# Altium project HQ_RPI_T113_V04_162.PrjPcb (part 1 of 2)
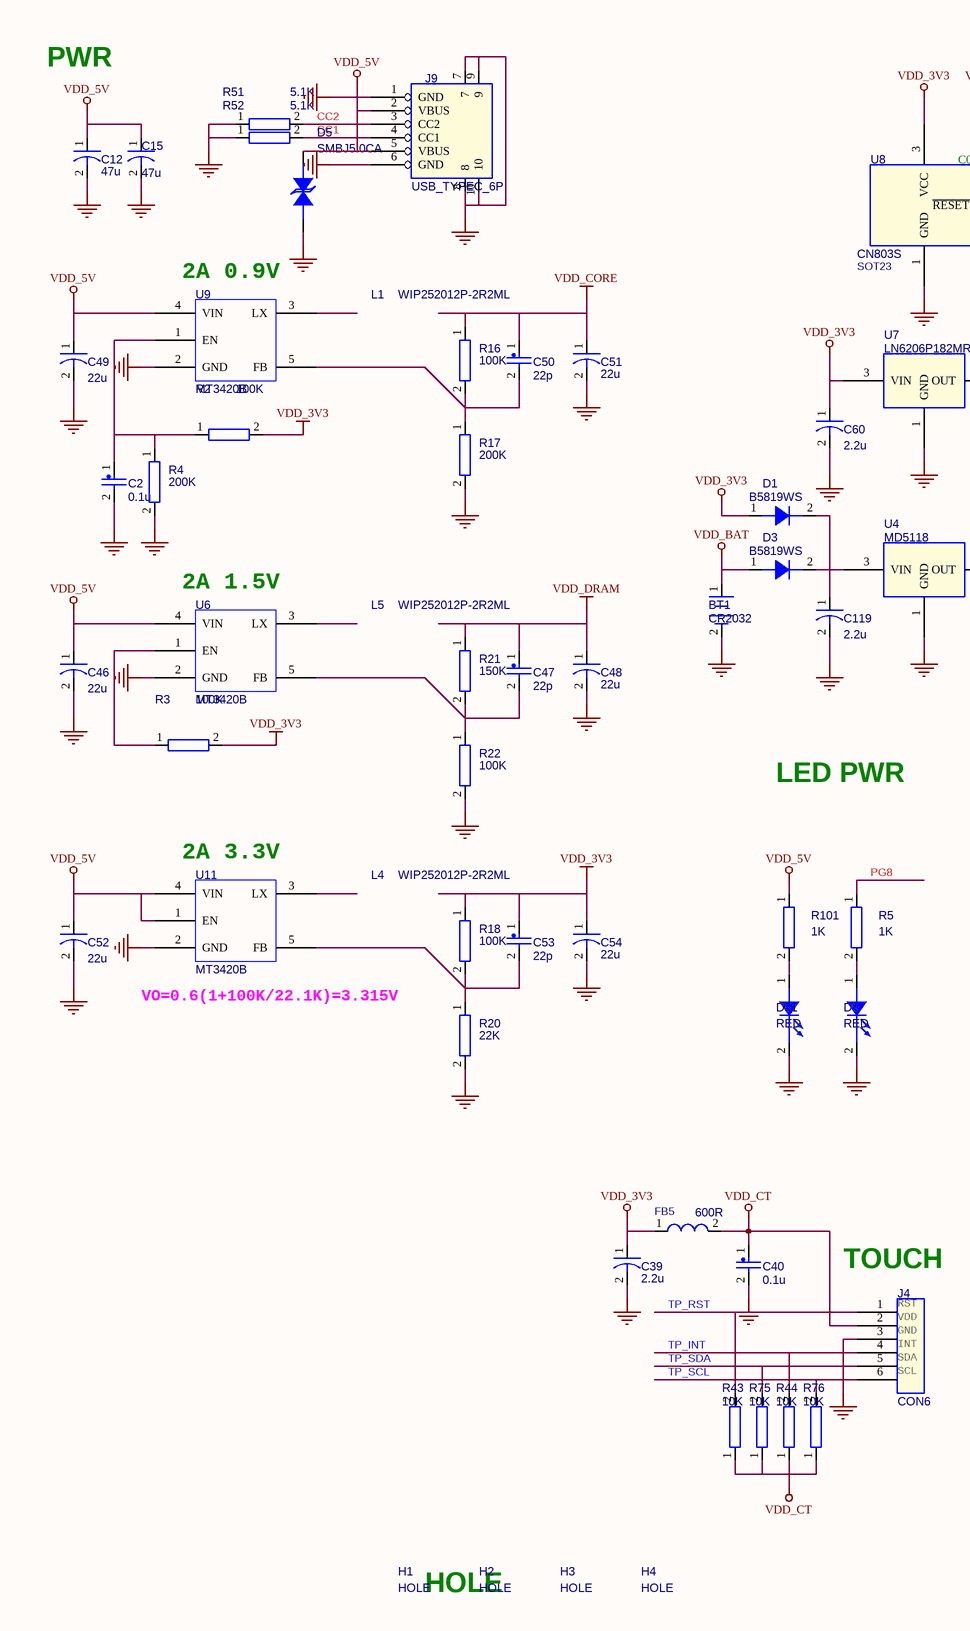
[diagram p0: MAIN.SchDoc, top left]
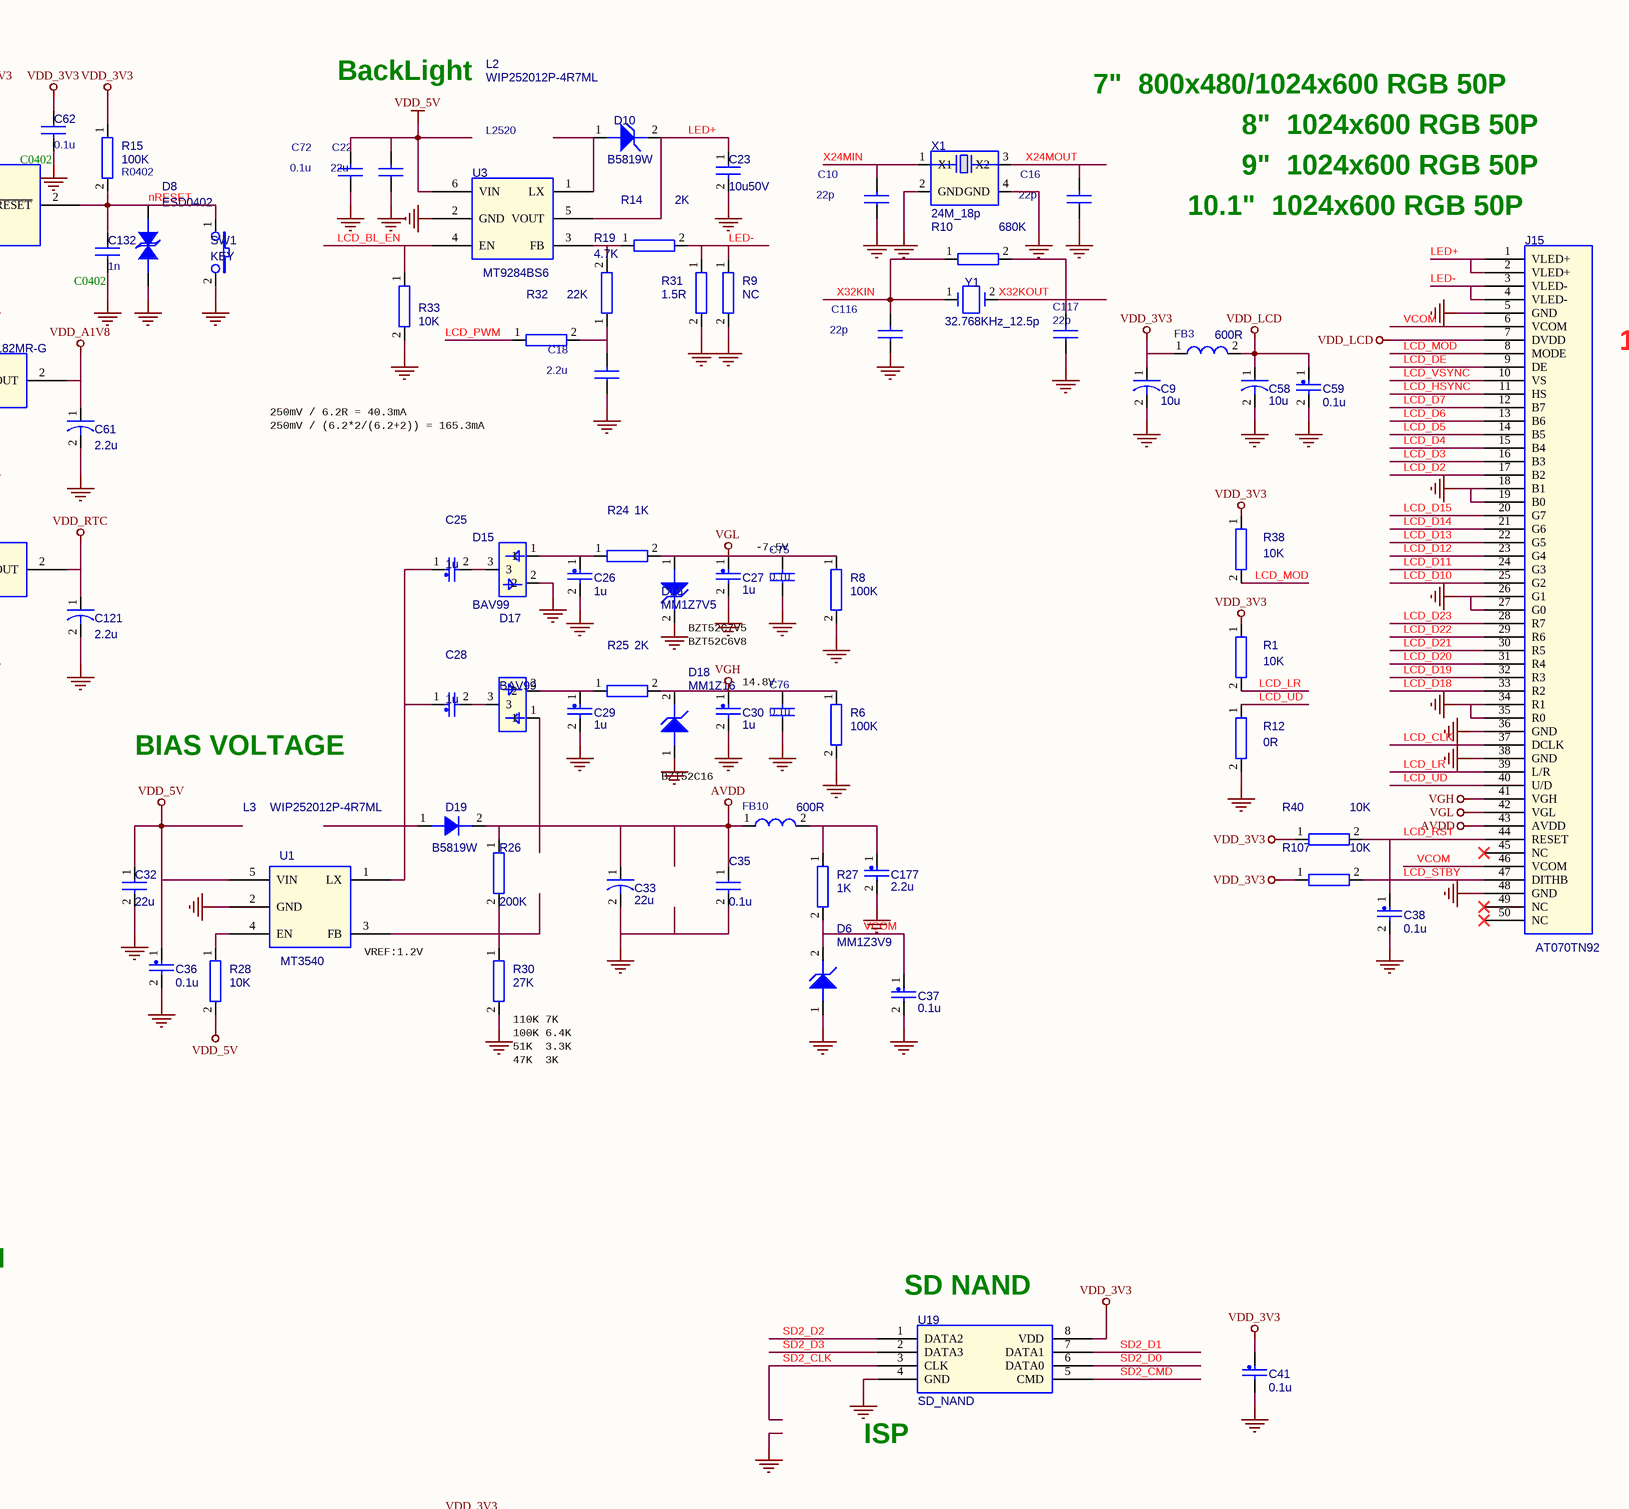
[diagram p1: MAIN.SchDoc, top middle]
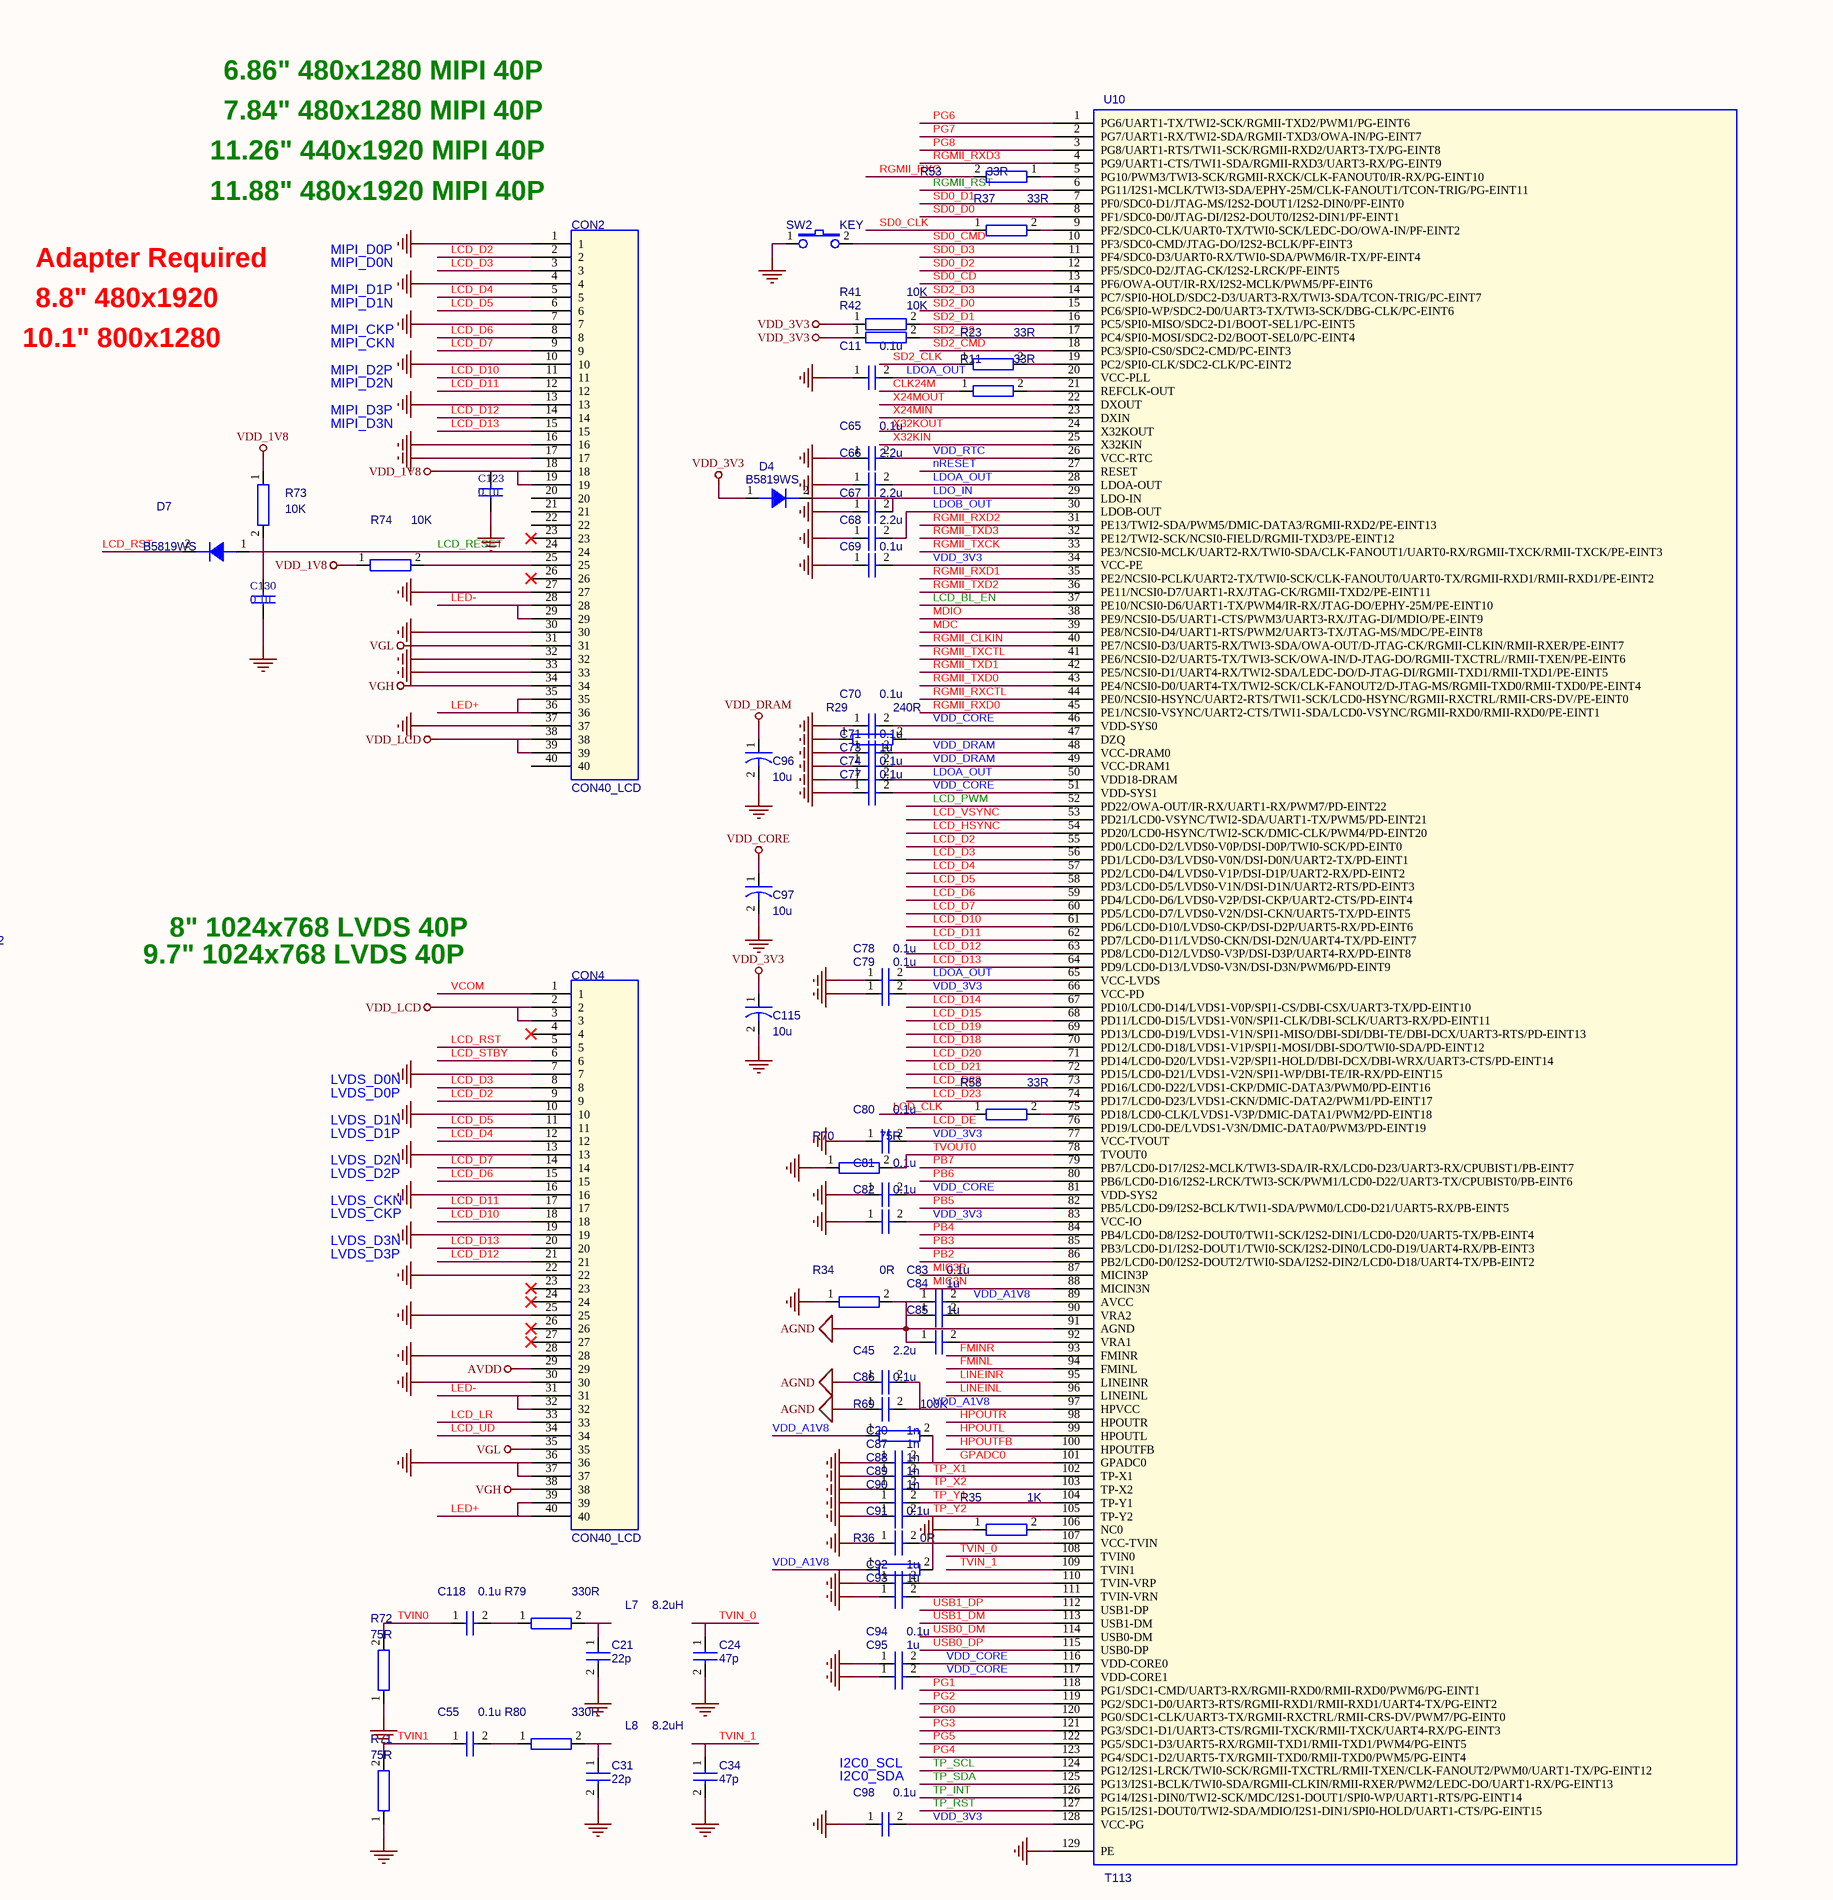
[diagram p2: MAIN.SchDoc, top right]
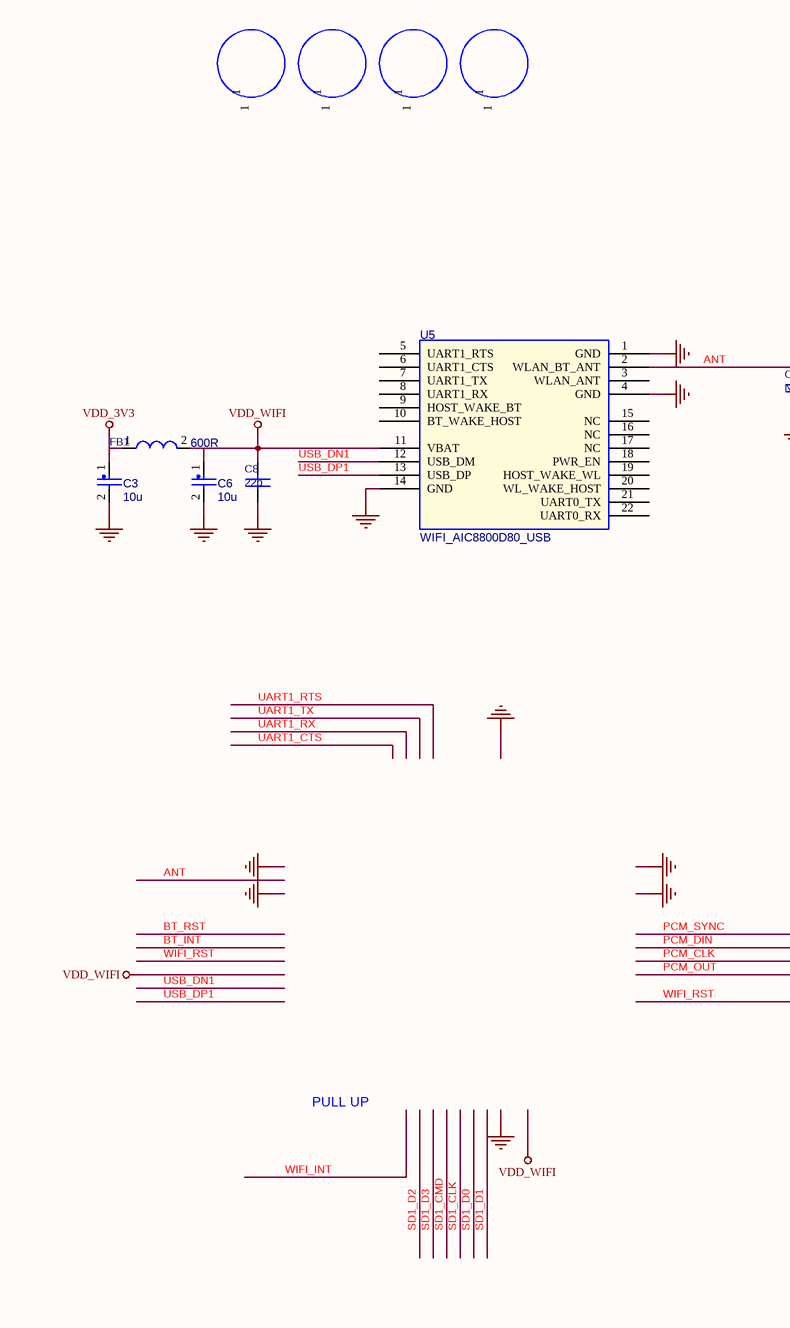
[diagram p3: MAIN.SchDoc, bottom left]
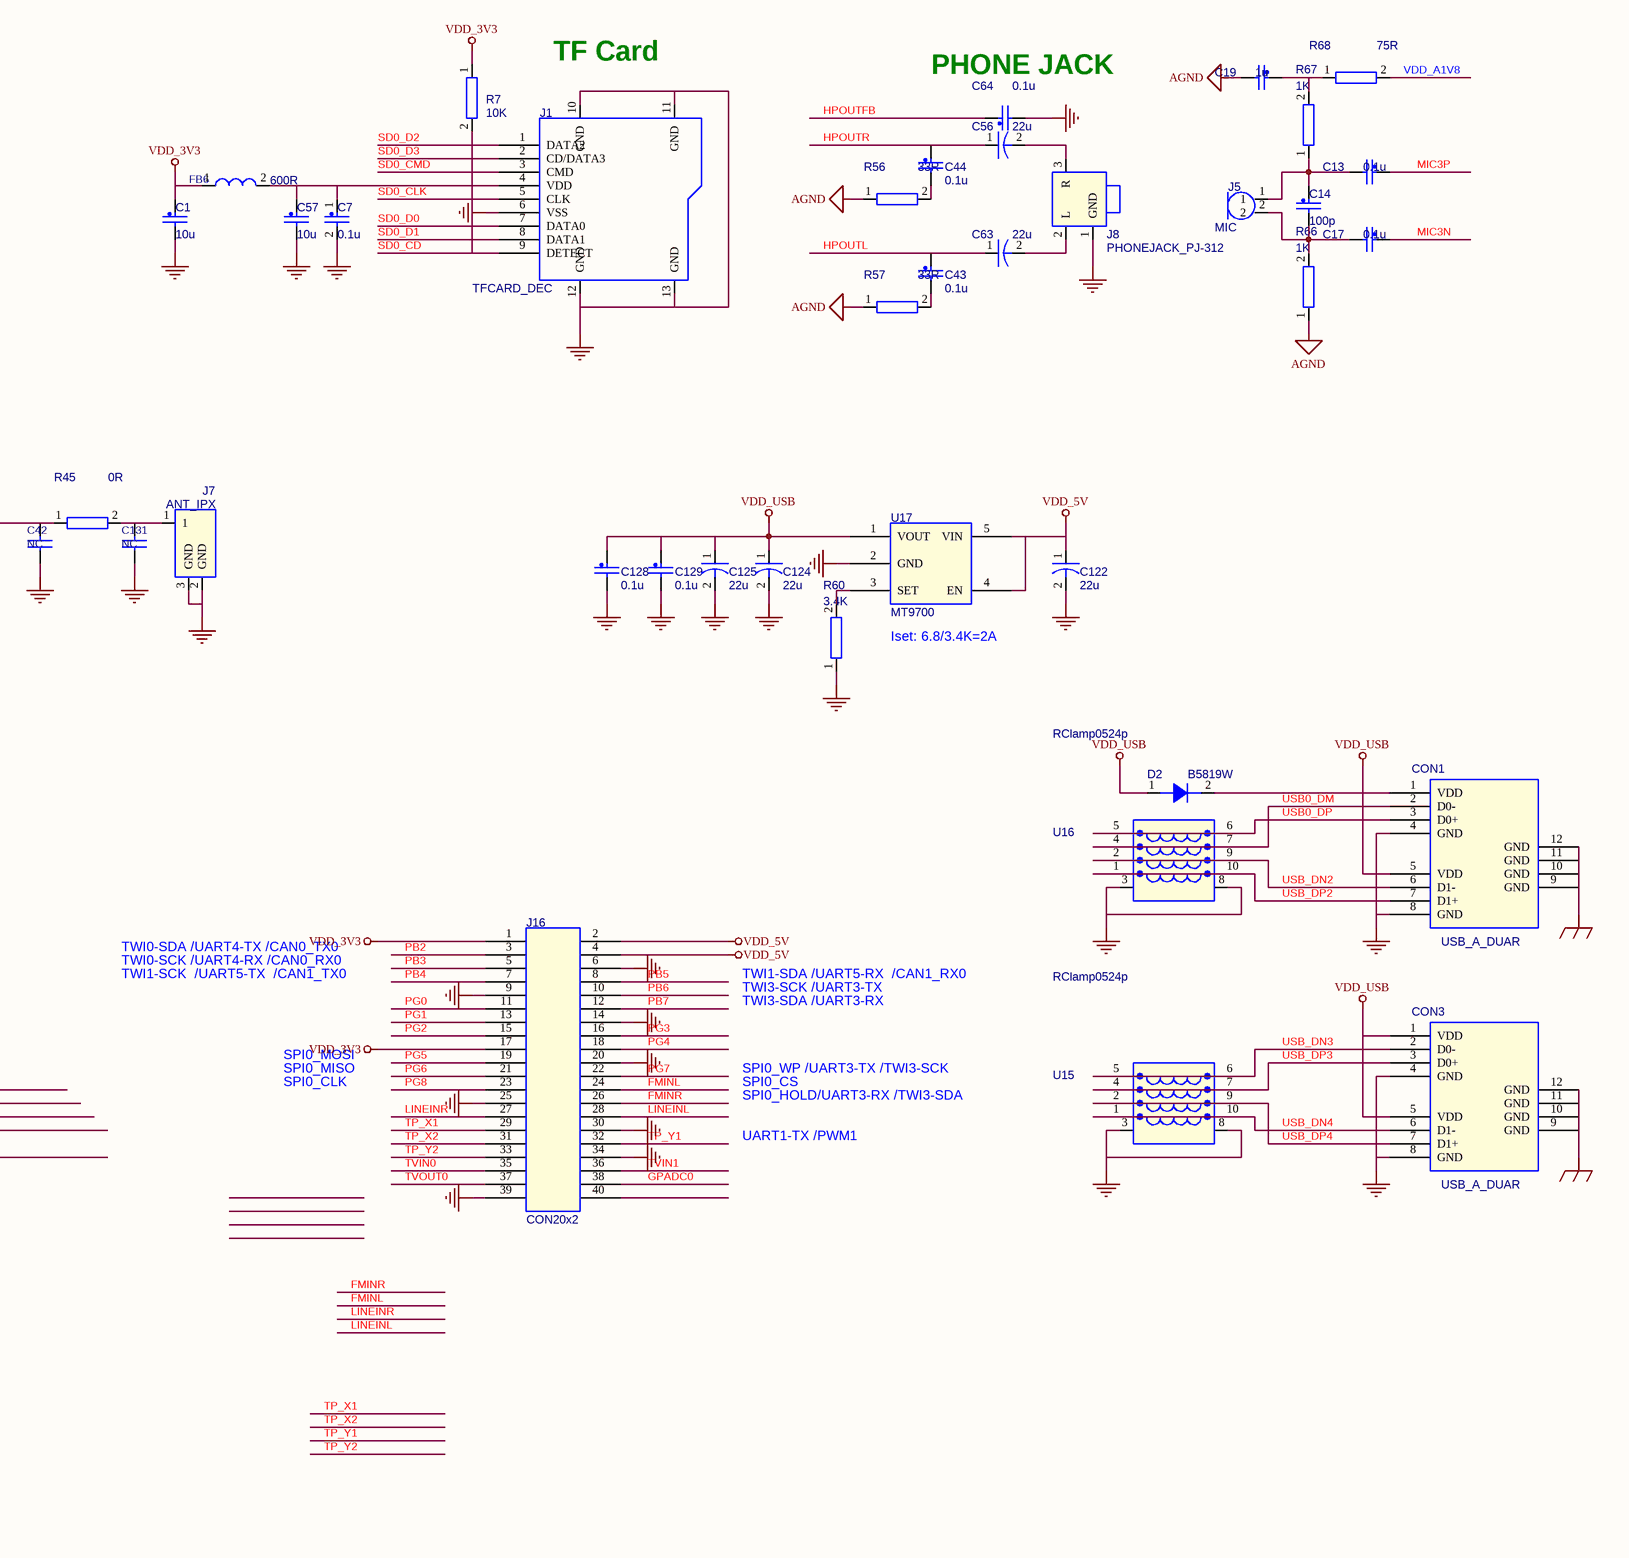
[diagram p4: MAIN.SchDoc, bottom middle]
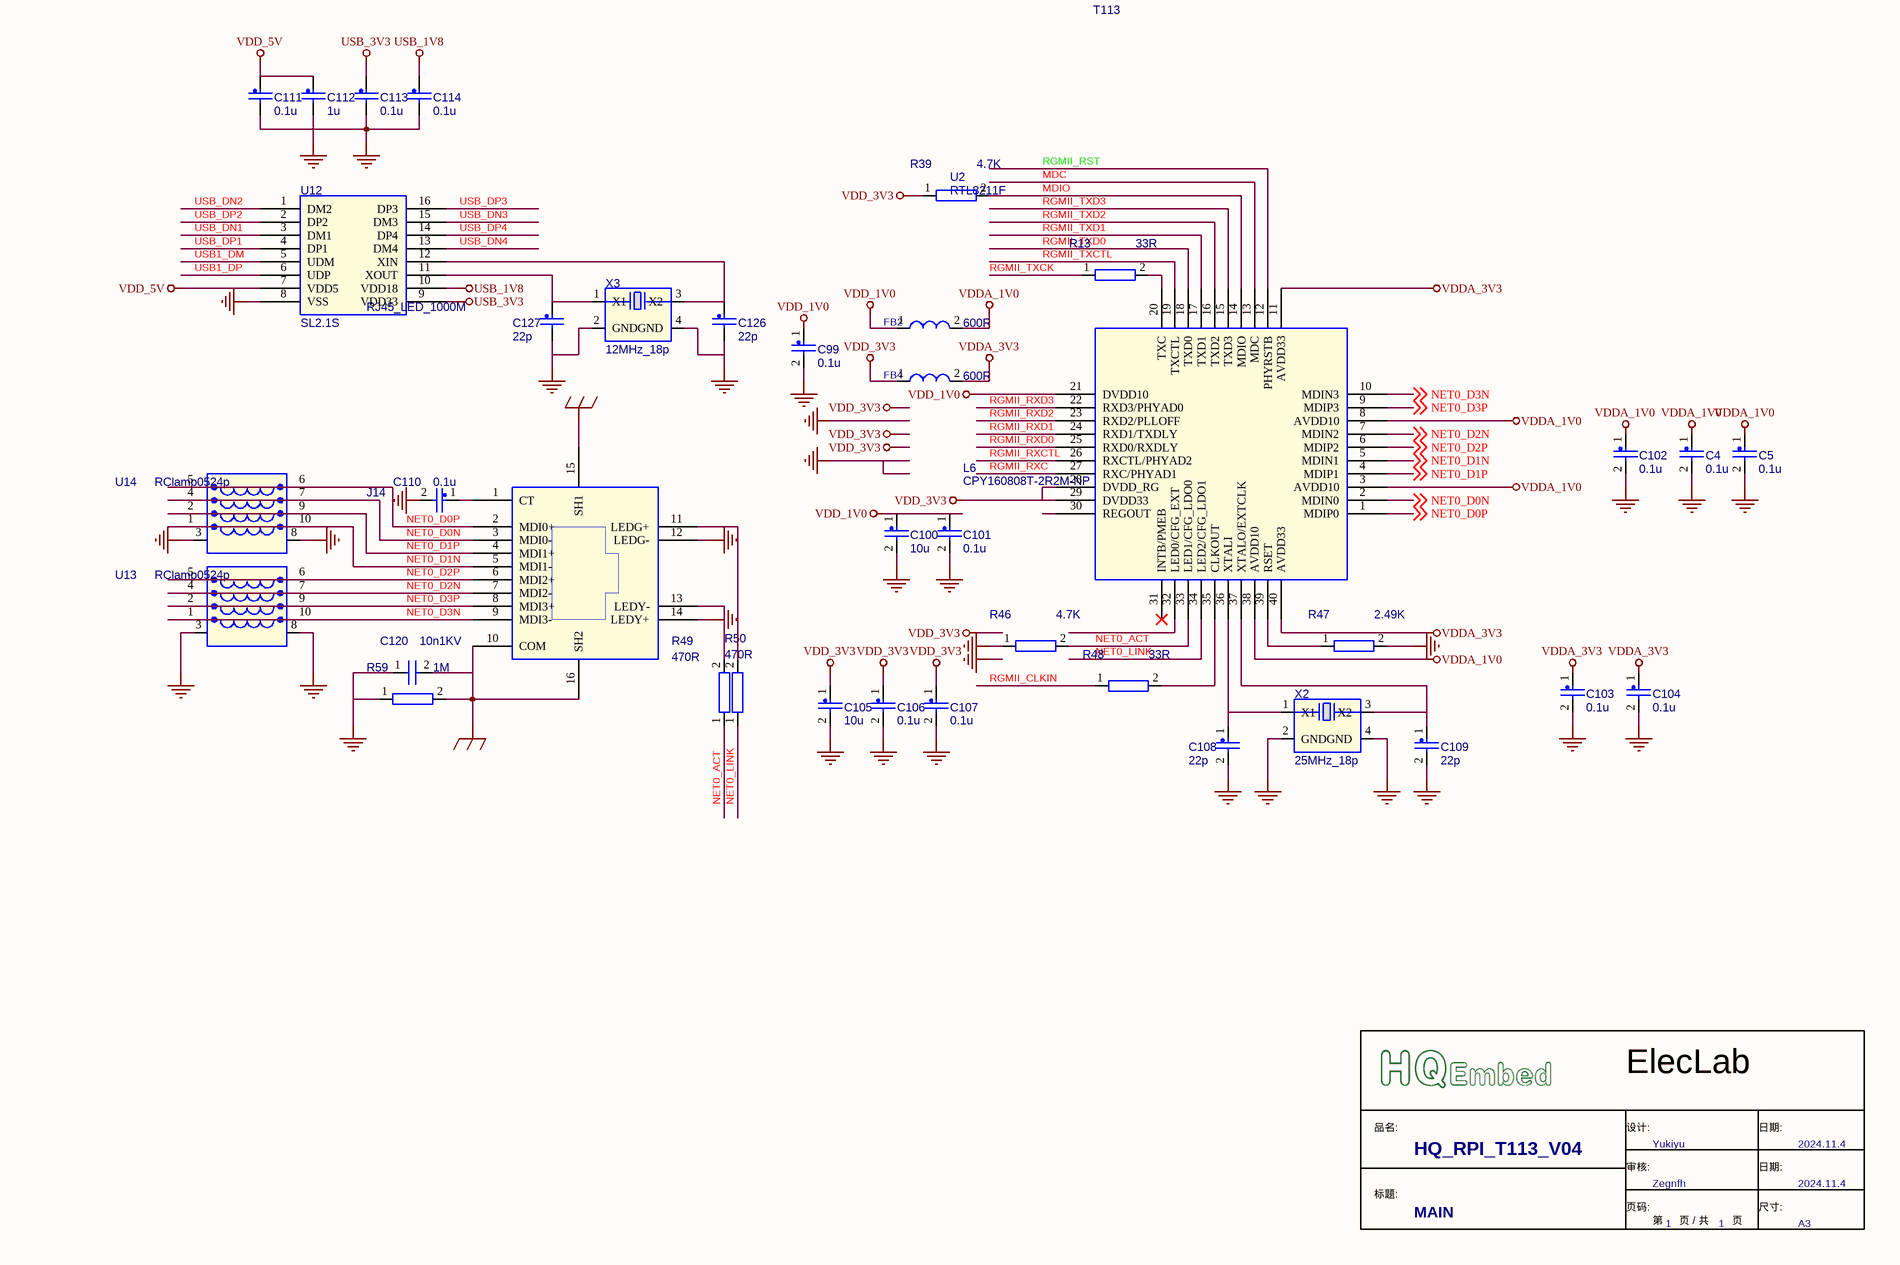
[diagram p5: MAIN.SchDoc, bottom right]
1 sheet, 280 parts. Net scope: global (net labels, ports and power ports of the same name join across sheets).